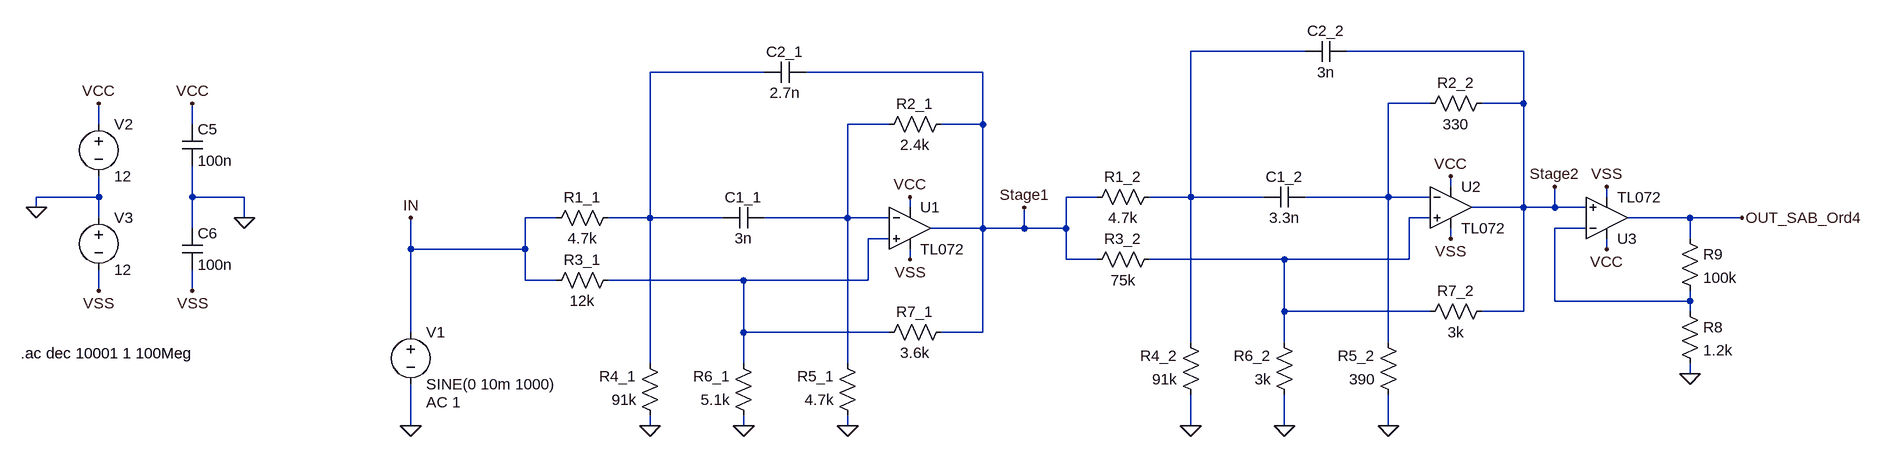
[diagram p0: schematic SAB_ordnung4_10kHz_1dB_30dB_inv_cheby.asc]
SAB_ordnung4_10kHz_1dB_30dB_inv_cheby.asc, the LTspice schematic file:
Version 4
SHEET 1 2564 736
WIRE 1376 80 1200 80
WIRE 1712 80 1440 80
WIRE 544 112 368 112
WIRE 880 112 608 112
WIRE 1568 160 1504 160
WIRE 1712 160 1712 80
WIRE 1712 160 1648 160
WIRE -480 192 -480 160
WIRE -336 192 -336 160
WIRE 736 192 672 192
WIRE 880 192 880 112
WIRE 880 192 816 192
WIRE 1600 288 1600 272
WIRE -480 304 -480 272
WIRE -480 304 -576 304
WIRE -336 304 -336 256
WIRE -256 304 -336 304
WIRE 1056 304 1008 304
WIRE 1200 304 1200 80
WIRE 1200 304 1136 304
WIRE 1312 304 1200 304
WIRE 1504 304 1504 160
WIRE 1504 304 1376 304
WIRE 1568 304 1504 304
WIRE 1840 304 1840 288
WIRE -576 320 -576 304
WIRE 768 320 768 304
WIRE 1712 320 1712 160
WIRE 1712 320 1632 320
WIRE 1760 320 1760 288
WIRE 1760 320 1712 320
WIRE 1808 320 1760 320
WIRE -480 336 -480 304
WIRE -256 336 -256 304
WIRE 224 336 176 336
WIRE 368 336 368 112
WIRE 368 336 304 336
WIRE 480 336 368 336
WIRE 672 336 672 192
WIRE 672 336 544 336
WIRE 736 336 672 336
WIRE 1568 336 1536 336
WIRE 1968 336 1872 336
WIRE 2048 336 1968 336
WIRE -336 352 -336 304
WIRE 880 352 880 192
WIRE 880 352 800 352
WIRE 944 352 944 320
WIRE 944 352 880 352
WIRE 1008 352 1008 304
WIRE 1008 352 944 352
WIRE 1808 352 1760 352
WIRE 736 368 704 368
WIRE 1600 368 1600 352
WIRE 1968 368 1968 336
WIRE 0 384 0 336
WIRE 176 384 176 336
WIRE 176 384 0 384
WIRE 1840 384 1840 368
WIRE 768 400 768 384
WIRE 1008 400 1008 352
WIRE 1056 400 1008 400
WIRE 1344 400 1136 400
WIRE 1536 400 1536 336
WIRE 1536 400 1344 400
WIRE 176 432 176 384
WIRE 224 432 176 432
WIRE 512 432 304 432
WIRE 704 432 704 368
WIRE 704 432 512 432
WIRE -480 448 -480 416
WIRE -336 448 -336 416
WIRE 1760 464 1760 352
WIRE 1968 464 1968 448
WIRE 1968 464 1760 464
WIRE 1344 480 1344 400
WIRE 1568 480 1344 480
WIRE 1712 480 1712 320
WIRE 1712 480 1648 480
WIRE 1968 480 1968 464
WIRE 0 512 0 384
WIRE 512 512 512 432
WIRE 736 512 512 512
WIRE 880 512 880 352
WIRE 880 512 816 512
WIRE 1200 528 1200 304
WIRE 1344 528 1344 480
WIRE 1504 528 1504 304
WIRE 368 560 368 336
WIRE 512 560 512 512
WIRE 672 560 672 336
WIRE 1968 576 1968 560
WIRE 0 656 0 592
WIRE 368 656 368 640
WIRE 512 656 512 640
WIRE 672 656 672 640
WIRE 1200 656 1200 608
WIRE 1344 656 1344 608
WIRE 1504 656 1504 608
FLAG -480 160 VCC
FLAG -480 448 VSS
FLAG -576 320 0
FLAG -336 160 VCC
FLAG -336 448 VSS
FLAG -256 336 0
FLAG 0 656 0
FLAG 0 336 IN
FLAG 768 304 VCC
FLAG 768 400 VSS
FLAG 368 656 0
FLAG 512 656 0
FLAG 672 656 0
FLAG 1600 272 VCC
FLAG 1600 368 VSS
FLAG 1200 656 0
FLAG 1344 656 0
FLAG 1504 656 0
FLAG 944 320 Stage1
FLAG 1968 576 0
FLAG 1840 288 VSS
FLAG 1840 384 VCC
FLAG 1760 288 Stage2
FLAG 2048 336 OUT_SAB_Ord4
SYMBOL voltage 0 496 R0
WINDOW 123 24 124 Left 2
WINDOW 39 0 0 Left 0
SYMATTR Value2 AC 1
SYMATTR InstName V1
SYMATTR Value SINE(0 10m 1000)
SYMBOL voltage -480 176 R0
WINDOW 123 0 0 Left 0
WINDOW 39 0 0 Left 0
SYMATTR InstName V2
SYMATTR Value 12
SYMBOL voltage -480 320 R0
WINDOW 123 0 0 Left 0
WINDOW 39 0 0 Left 0
SYMATTR InstName V3
SYMATTR Value 12
SYMBOL cap -352 192 R0
SYMATTR InstName C5
SYMATTR Value 100n
SYMBOL cap -352 352 R0
SYMATTR InstName C6
SYMATTR Value 100n
SYMBOL res 320 320 R90
WINDOW 0 0 56 VBottom 2
WINDOW 3 32 56 VTop 2
SYMATTR InstName R1_1
SYMATTR Value 4.7k
SYMBOL res 832 176 R90
WINDOW 0 0 56 VBottom 2
WINDOW 3 32 56 VTop 2
SYMATTR InstName R2_1
SYMATTR Value 2.4k
SYMBOL res 320 416 R90
WINDOW 0 0 56 VBottom 2
WINDOW 3 32 56 VTop 2
SYMATTR InstName R3_1
SYMATTR Value 12k
SYMBOL res 384 656 R180
WINDOW 0 36 76 Left 2
WINDOW 3 36 40 Left 2
SYMATTR InstName R4_1
SYMATTR Value 91k
SYMBOL res 688 656 R180
WINDOW 0 36 76 Left 2
WINDOW 3 36 40 Left 2
SYMATTR InstName R5_1
SYMATTR Value 4.7k
SYMBOL res 528 656 R180
WINDOW 0 36 76 Left 2
WINDOW 3 36 40 Left 2
SYMATTR InstName R6_1
SYMATTR Value 5.1k
SYMBOL cap 544 320 R90
WINDOW 0 0 32 VBottom 2
WINDOW 3 32 32 VTop 2
SYMATTR InstName C1_1
SYMATTR Value 3n
SYMBOL cap 608 96 R90
WINDOW 0 0 32 VBottom 2
WINDOW 3 32 32 VTop 2
SYMATTR InstName C2_1
SYMATTR Value 2.7n
SYMBOL TL072 768 288 R0
SYMATTR InstName U1
SYMBOL res 832 496 R90
WINDOW 0 0 56 VBottom 2
WINDOW 3 32 56 VTop 2
SYMATTR InstName R7_1
SYMATTR Value 3.6k
SYMBOL res 1152 288 R90
WINDOW 0 0 56 VBottom 2
WINDOW 3 32 56 VTop 2
SYMATTR InstName R1_2
SYMATTR Value 4.7k
SYMBOL res 1664 144 R90
WINDOW 0 0 56 VBottom 2
WINDOW 3 32 56 VTop 2
SYMATTR InstName R2_2
SYMATTR Value 330
SYMBOL res 1152 384 R90
WINDOW 0 0 56 VBottom 2
WINDOW 3 32 56 VTop 2
SYMATTR InstName R3_2
SYMATTR Value 75k
SYMBOL res 1216 624 R180
WINDOW 0 36 76 Left 2
WINDOW 3 36 40 Left 2
SYMATTR InstName R4_2
SYMATTR Value 91k
SYMBOL res 1520 624 R180
WINDOW 0 36 76 Left 2
WINDOW 3 36 40 Left 2
SYMATTR InstName R5_2
SYMATTR Value 390
SYMBOL res 1360 624 R180
WINDOW 0 36 76 Left 2
WINDOW 3 36 40 Left 2
SYMATTR InstName R6_2
SYMATTR Value 3k
SYMBOL cap 1376 288 R90
WINDOW 0 0 32 VBottom 2
WINDOW 3 32 32 VTop 2
SYMATTR InstName C1_2
SYMATTR Value 3.3n
SYMBOL cap 1440 64 R90
WINDOW 0 0 32 VBottom 2
WINDOW 3 32 32 VTop 2
SYMATTR InstName C2_2
SYMATTR Value 3n
SYMBOL TL072 1600 256 R0
SYMATTR InstName U2
SYMBOL res 1664 464 R90
WINDOW 0 0 56 VBottom 2
WINDOW 3 32 56 VTop 2
SYMATTR InstName R7_2
SYMATTR Value 3k
SYMBOL res 1952 464 R0
SYMATTR InstName R8
SYMATTR Value 1.2k
SYMBOL res 1952 352 R0
SYMATTR InstName R9
SYMATTR Value 100k
SYMBOL TL072 1840 400 M180
SYMATTR InstName U3
TEXT -600 544 Left 2 !.ac dec 10001 1 100Meg

The netlist it stands for:
* SAB_ordnung4_10kHz_1dB_30dB_inv_cheby.asc
V1 IN 0 SINE(0 10m 1000) AC 1
V2 VCC 0 12
V3 0 VSS 12
C5 VCC 0 100n
C6 0 VSS 100n
R1_1 N002 IN 4.7k
R2_1 Stage1 N004 2.4k
R3_1 N007 IN 12k
R4_1 0 N002 91k
R5_1 0 N004 4.7k
R6_1 0 N007 5.1k
C1_1 N004 N002 3n
C2_1 Stage1 N002 2.7n
* U1: TL072 (symbol TL072 not available, pins judged from their places): In+=N007 In-=N004 V+=VCC V-=VSS OUT=Stage1
R7_1 Stage1 N007 3.6k
R1_2 N001 Stage1 4.7k
R2_2 Stage2 N003 330
R3_2 N005 Stage1 75k
R4_2 0 N001 91k
R5_2 0 N003 390
R6_2 0 N005 3k
C1_2 N003 N001 3.3n
C2_2 Stage2 N001 3n
* U2: TL072 (symbol TL072 not available, pins judged from their places): In+=N005 In-=N003 V+=VCC V-=VSS OUT=Stage2
R7_2 Stage2 N005 3k
R8 N006 0 1.2k
R9 OUT_SAB_Ord4 N006 100k
* U3: TL072 (symbol TL072 not available, pins judged from their places): In+=Stage2 In-=N006 V+=VCC V-=VSS OUT=OUT_SAB_Ord4
.ac dec 10001 1 100Meg
.backanno
.end